# Altium schematic sheet Power_Supply.SchDoc
size A3
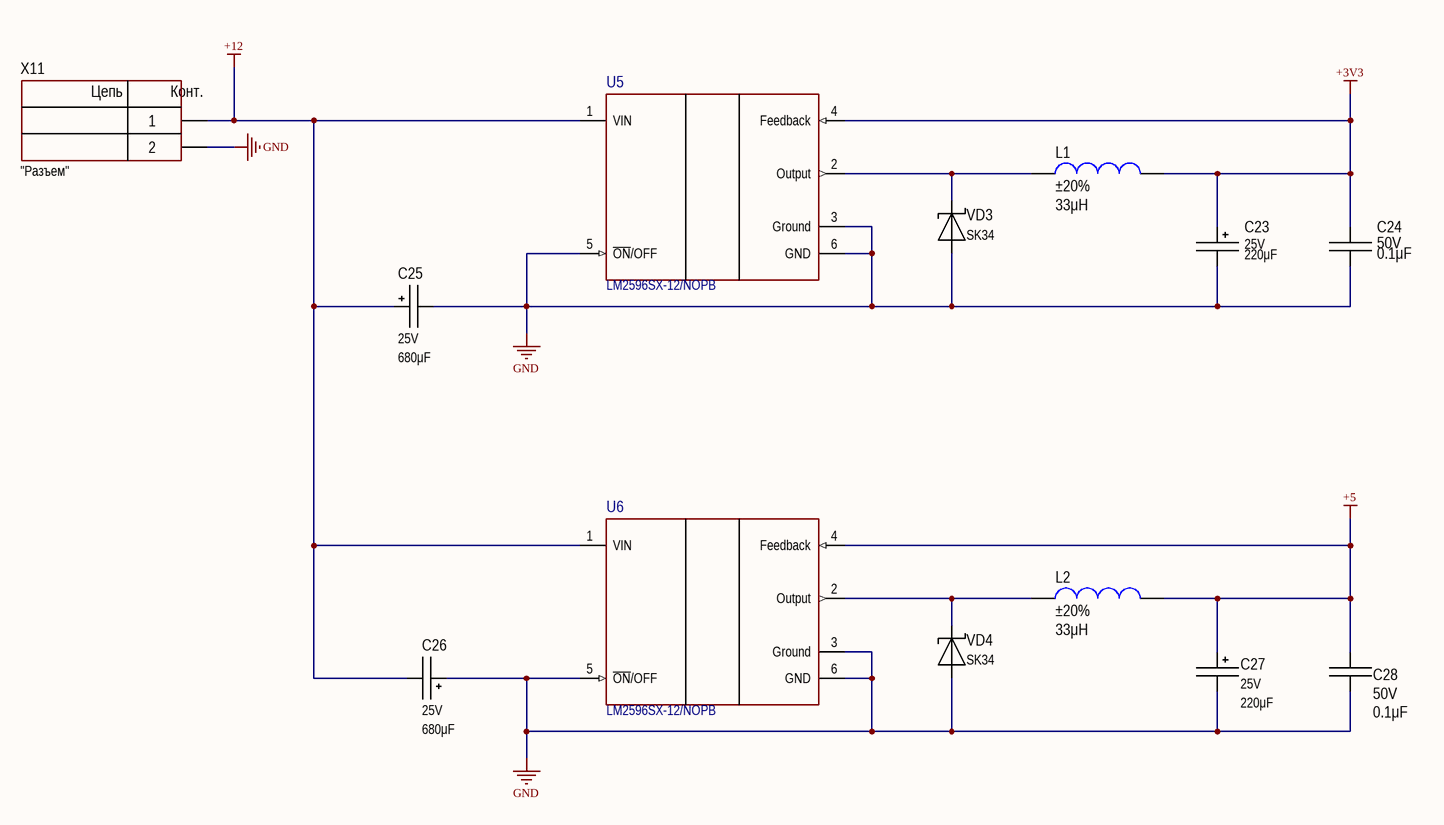
[diagram p0: Power_Supply.SchDoc]

## Parts
C23  value 220μF  Voltage: 25V  [CAP: D10C5H16]
C24  value 0.1μF  Voltage: 50V  [CAP: 1206]
C25  value 680μF  Voltage: 25V  [CAP: D10C5H16]
C26  value 680μF  Voltage: 25V  [CAP: D10C5H16]
C27  value 220μF  Voltage: 25V  [CAP: D10C5H16]
C28  value 0.1μF  Voltage: 50V  [CAP: 1206]
L1  value 33μH  Tolerance: ±20%  [SRR1208-101YL]
L2  value 33μH  Tolerance: ±20%  [SRR1208-101YL]
U5  LM2596SX-12/NOPB  [FP-KTT0005B-MFG]
U6  LM2596SX-12/NOPB  [FP-KTT0005B-MFG]
VD3  PartNumber: SK34  [DIODE: SMC]
VD4  PartNumber: SK34  [DIODE: SMC]
X11  CommentText: "Разъем"  [CON: DG350-3.5-02P]

## Nets
+3V3: C23.1 C24.2 L1.1 U5.4(Feedback)
+5: C27.1 C28.2 L2.1 U6.4(Feedback)
+12: C25.1 C26.2 U5.1(VIN) U6.1(VIN) X11.1
GND: C23.2 C24.1 C25.2 C26.1 C27.2 C28.1 U5.3(Ground) U5.5(~{ON}/OFF) U5.6(GND) U6.3(Ground) U6.5(~{ON}/OFF) U6.6(GND) VD3.1 VD4.1 X11.2
NetL1_2: L1.2 U5.2(Output) VD3.2
NetL2_2: L2.2 U6.2(Output) VD4.2

## Notes on the sheet
- (in symbol Connector_terminal_2pin) Цепь; Конт.

## Library data of the parts
C23 C27 = Aluminium: Manufacturer: Wurth; PartNumber: 860080475013; ValueManufacturerPartNumber: Aluminium capacitor, 220μF, 25V, ±20%, 54mOhm, 14x10x5 mm, -55...+105°C; TypeCapacitor: Aluminium capacitor; Tolerance: ±20%; Impedance: 54mOhm; Package: 14x10x5 mm; HelpURL: https://www.digikey.com/product-detail/en/wurth-electronics-inc/860080475013/732-9029-1-ND/5728972; Temperature: -55...+105°C
C24 C28 = Ceramic_1206: Manufacturer: Yageo; PartNumber: CC1206KRX7R9BB104; ValueManufacturerPartNumber: Ceramic capacitor, 0.1μF, X7R, ±10%, 50V, 1206, -55...+125°C; TypeCapacitor: Ceramic capacitor; Tolerance: ±10%; TypeDielectric: X7R; Package: 1206; HelpURL: https://www.digikey.com/product-detail/en/yageo/CC1206KRX7R9BB104/311-1179-1-ND/303089; Temperature: -55...+125°C
C25 C26 = Aluminium: Manufacturer: Wurth; PartNumber: 860080475013; ValueManufacturerPartNumber: Aluminium capacitor, 680μF, 25V, ±20%, 54mOhm, 14x10x5 mm, -55...+105°C; TypeCapacitor: Aluminium capacitor; Tolerance: ±20%; Impedance: 54mOhm; Package: 14x10x5 mm; HelpURL: https://www.digikey.com/product-detail/en/wurth-electronics-inc/860080475013/732-9029-1-ND/5728972; Temperature: -55...+105°C
L1 L2 = Inductor_SDR0403: Manufacturer: Bourns; PartNumber: SDR0403-4R7ML; ValueManufacturerPartNumber: Fixed inductor, 33μH, ±20%, SDR0403, 1.7A, -40...+125°C; TypeInductor: Fixed inductor; MaxCurrent: 1.7A; Package: SDR0403; HelpURL: https://www.digikey.com/product-detail/en/bourns-inc/SDR0403-4R7ML/SDR0403-4R7MLCT-ND/2127096; Temperature: -40...+125°C
U5 U6 = CMP-04918-000013-1: IC REG BUCK 12V 3A TO263-5; Manufacturer: Texas Instruments; Max Duty Cycle: 100%; Max Junction Temp: +150°C; Min Supply Voltage: 4.5V; Max Supply Voltage: 40V; Standoff Height: 0mm; Switching Frequency: 150kHz; Nominal Supply Current: 5mA; Number Of Outputs: 1; Output Type: Fixed; Device Class L1: Integrated Circuits (ICs); ComponentLink2Description: Datasheet; Height: 4.8mm; Switching Topology: Buck; Device Class L2: Power Management ICs; Temperature Range Low: -40°C; Output Voltage: 12V; Lead Free: Yes; Digikey Description: IC REG BUCK 12V 3A TO263-5; Device Class L3: Voltage Regulators - Switching; Manufacturer Part Number: LM2596SX-12/NOPB; Octopart: https://octopart.com/lm2596sx-12%2Fnopb-texas+instruments-24812942; Mouser Description: SIMPLE SWITCHER® 4.5V to 40V, 3A Low Component Count Step-Down Regulator 5-DDPAK/TO-263; Package: KTT0005B; Output Current: 3A; Automotive: No; Temperature: -40°C to +125°C; RoHS: TRUE; Temperature Range High: +125°C; Category: IC; ComponentLink2URL: http://www.ti.com/lit/ds/symlink/lm2596.pdf
VD3 VD4 = Schottky_single: Manufacturer: Diodes Incorporated; ValueManufacturerPartNumber: Schottky diode, 80V, 500mA, 1V, 15pF, SOD-123, -55...+150°C; TypeDiode: Schottky diode; Voltage: 80V; Current: 500mA; VoltageDrop: 1V; RecoveryTime: 15pF; Package: SOD-123; HelpURL: https://www.digikey.com/product-detail/en/diodes-incorporated/MBR0580S1-7/MBR0580S1-7DICT-ND/5080371; Temperature: -55...+150°C
X11 = Connector_terminal_2pin: Manufacturer: Degson; ValueManufacturerPartNumber: Terminal connector, 2pin, 3.5mm, 300VAC, 10A; PartNumber: DG350-3.5-02P-14; TypeConnector: Terminal connector; VoltageMax: 300VAC; Pitch: 3.5mm; CurrentMax: 10A; Multichannel: 2pin; HelpURL: https://www.chipdip.ru/product/dg350-3.5-02p-12